# Altium schematic sheet Sheet1.SchDoc
size A4; SheetNumber: 1; SheetTotal: 1
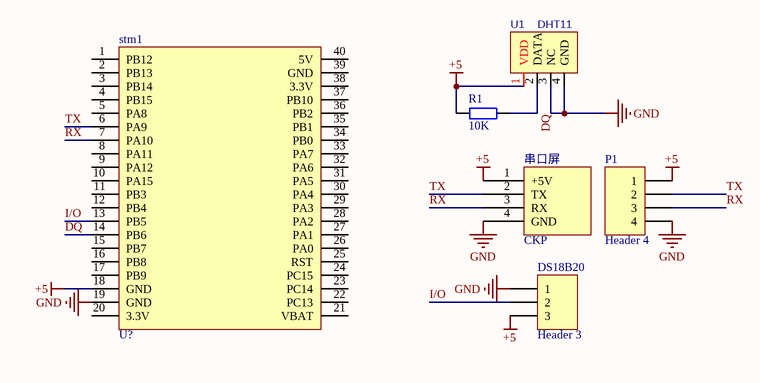
[diagram p0: Sheet1.SchDoc]

## Parts
DS18B20  Header 3  [HDR1X3]
P1  Header 4  [HDR1X4]
R1  10K  [R 0805_L]
stm1  U?  [stm32f4x1cxu6_core]
U1  DHT11  [HT11A]
串口屏  CKP  [CKP]

## Nets
+5: DS18B20.3 P1.1 R1.1 stm1.18(GND) U1.1(VDD) 串口屏.1(+5V)
GND: DS18B20.1 P1.4 stm1.19(GND) U1.3(NC) U1.4(GND) 串口屏.4(GND)
DQ: R1.2 stm1.14(PB6) U1.2(DATA)
I/O: DS18B20.2 stm1.13(PB5)
RX: P1.3 stm1.7(PA10) 串口屏.3(RX)
TX: P1.2 stm1.6(PA9) 串口屏.2(TX)

Not connected (* = marked no-connect by the designer): stm1 1(PB12) 2(PB13) 3(PB14) 4(PB15) 5(PA8) 8(PA11) 9(PA12) 10(PA15) 11(PB3) 12(PB4) 15(PB7) 16(PB8) 17(PB9) 20(3.3V) 21(VBAT) 22(PC13) 23(PC14) 24(PC15) 25(RST) 26(PA0) 27(PA1) 28(PA2) 29(PA3) 30(PA4) 31(PA5) 32(PA6) 33(PA7) 34(PB0) 35(PB1) 36(PB2) 37(PB10) 38(3.3V) 39(GND) 40(5V)

## Library data of the parts
DS18B20 = Header 3: Header, 3-Pin; LatestRevisionDate: 17-Jul-2002; LatestRevisionNote: Re-released for DXP Platform.; Publisher: Altium Limited
P1 = Header 4: Header, 4-Pin; LatestRevisionDate: 17-Jul-2002; LatestRevisionNote: Re-released for DXP Platform.; Publisher: Altium Limited
R1 = R: 贴片电阻; 淘宝ID: 小糖豆的小窝窝; BOM名称: 贴片电阻; 下单链接: https://item.taobao.com/item.htm?ft=t&id=613637044352
stm1 = stm32f4x1cxu6_core
U1 = DHT11: 电容式温湿度传感器; 淘宝ID: 小糖豆的小窝窝; BOM名称: 电容式温湿度传感器; 下单链接: https://item.taobao.com/item.htm?ft=t&id=613637044352